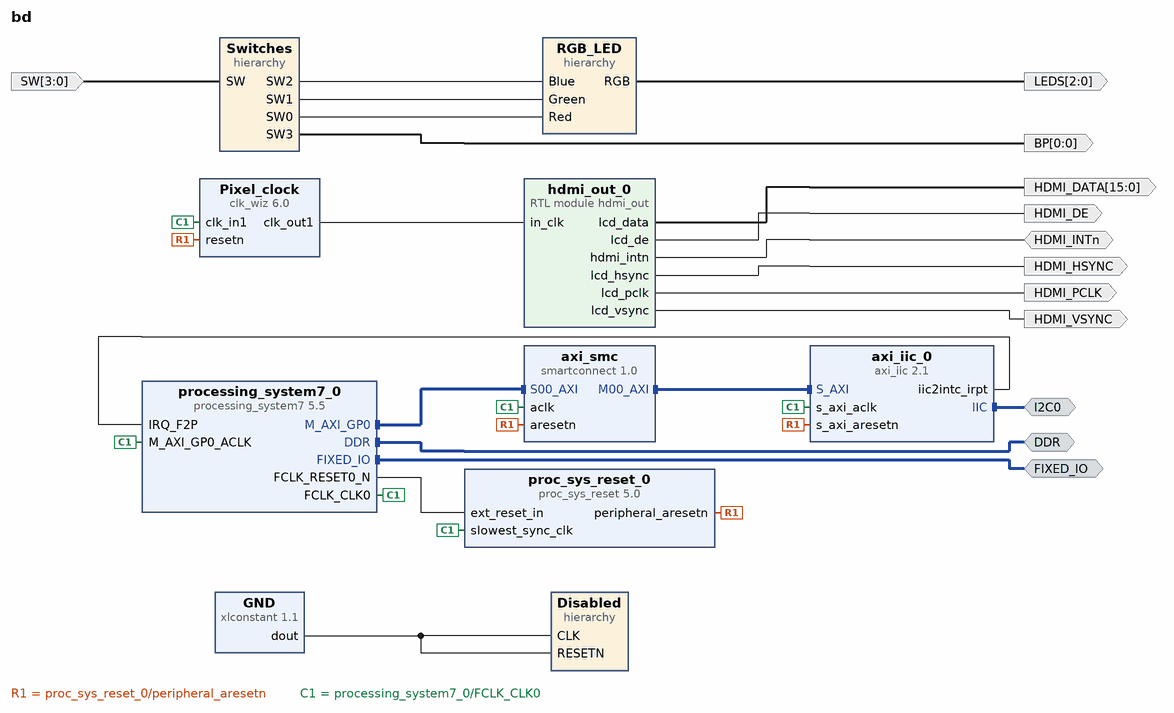
[diagram p0: block diagram of the top level]
# Vivado block design bd, xc7z020clg400-1, Vivado 2024.2.1
create_bd_design bd

create_bd_intf_port -mode Master -vlnv xilinx.com:interface:ddrx_rtl:1.0 DDR
create_bd_intf_port -mode Master -vlnv xilinx.com:display_processing_system7:fixedio_rtl:1.0 FIXED_IO
create_bd_intf_port -mode Master -vlnv xilinx.com:interface:iic_rtl:1.0 I2C0
create_bd_port -dir O HDMI_PCLK
create_bd_port -dir O -from 15 -to 0 HDMI_DATA
create_bd_port -dir O HDMI_DE
create_bd_port -dir IO HDMI_INTn
create_bd_port -dir O HDMI_VSYNC
create_bd_port -dir O HDMI_HSYNC
create_bd_port -dir I -from 3 -to 0 SW
create_bd_port -dir O -from 2 -to 0 LEDS
create_bd_port -dir O -from 0 -to 0 BP

create_bd_cell -type ip -vlnv xilinx.com:ip:clk_wiz:6.0 Pixel_clock
set_property -dict [list \
  CONFIG.CLKOUT1_JITTER 219.225 \
  CONFIG.CLKOUT1_PHASE_ERROR 300.991 \
  CONFIG.CLKOUT1_REQUESTED_OUT_FREQ 115.2 \
  CONFIG.MMCM_CLKFBOUT_MULT_F 54.000 \
  CONFIG.MMCM_CLKOUT0_DIVIDE_F 9.375 \
  CONFIG.MMCM_DIVCLK_DIVIDE 5 \
  CONFIG.RESET_PORT resetn \
  CONFIG.RESET_TYPE ACTIVE_LOW \
  CONFIG.USE_LOCKED false \
  CONFIG.USE_RESET true \
] [get_bd_cells Pixel_clock]
create_bd_cell -type hier Disabled
create_bd_cell -type hier RGB_LED
create_bd_cell -type ip -vlnv xilinx.com:ip:xlconstant:1.1 GND
set_property -dict {CONFIG.CONST_VAL 0} [get_bd_cells GND]
create_bd_cell -type module -reference hdmi_out hdmi_out_0
create_bd_cell -type ip -vlnv xilinx.com:ip:proc_sys_reset:5.0 proc_sys_reset_0
create_bd_cell -type ip -vlnv xilinx.com:ip:processing_system7:5.5 processing_system7_0
set_property -dict [list \
  CONFIG.PCW_APU_PERIPHERAL_FREQMHZ 666.666666 \
  CONFIG.PCW_ENET0_PERIPHERAL_CLKSRC {ARM PLL} \
  CONFIG.PCW_ENET0_PERIPHERAL_ENABLE 0 \
  CONFIG.PCW_FPGA0_PERIPHERAL_FREQMHZ 100 \
  CONFIG.PCW_FPGA1_PERIPHERAL_FREQMHZ 50 \
  CONFIG.PCW_GPIO_MIO_GPIO_ENABLE 1 \
  CONFIG.PCW_GPIO_MIO_GPIO_IO MIO \
  CONFIG.PCW_GPIO_PERIPHERAL_ENABLE 1 \
  CONFIG.PCW_I2C_PERIPHERAL_FREQMHZ 111.111115 \
  CONFIG.PCW_I2C_RESET_ENABLE 1 \
  CONFIG.PCW_IRQ_F2P_INTR 1 \
  CONFIG.PCW_PRESET_BANK1_VOLTAGE {LVCMOS 1.8V} \
  CONFIG.PCW_QSPI_GRP_FBCLK_ENABLE 1 \
  CONFIG.PCW_QSPI_GRP_FBCLK_IO {MIO 8} \
  CONFIG.PCW_QSPI_GRP_SINGLE_SS_ENABLE 1 \
  CONFIG.PCW_QSPI_GRP_SINGLE_SS_IO {MIO 1 .. 6} \
  CONFIG.PCW_QSPI_PERIPHERAL_ENABLE 1 \
  CONFIG.PCW_QSPI_QSPI_IO {MIO 1 .. 6} \
  CONFIG.PCW_SD0_GRP_CD_ENABLE 1 \
  CONFIG.PCW_SD0_GRP_CD_IO {MIO 46} \
  CONFIG.PCW_SD0_GRP_WP_ENABLE 1 \
  CONFIG.PCW_SD0_GRP_WP_IO {MIO 47} \
  CONFIG.PCW_SD0_PERIPHERAL_ENABLE 1 \
  CONFIG.PCW_SD0_SD0_IO {MIO 40 .. 45} \
  CONFIG.PCW_SDIO_PERIPHERAL_FREQMHZ 100 \
  CONFIG.PCW_SINGLE_QSPI_DATA_MODE x4 \
  CONFIG.PCW_UART1_PERIPHERAL_ENABLE 1 \
  CONFIG.PCW_UART1_UART1_IO {MIO 48 .. 49} \
  CONFIG.PCW_UART_PERIPHERAL_FREQMHZ 100 \
  CONFIG.PCW_UIPARAM_DDR_PARTNO {MT41J256M16 RE-125} \
  CONFIG.PCW_USB0_PERIPHERAL_ENABLE 0 \
  CONFIG.PCW_USB_RESET_ENABLE 1 \
  CONFIG.PCW_USE_FABRIC_INTERRUPT 1 \
] [get_bd_cells processing_system7_0]
# 285 more settings of processing_system7_0 are not shown: defaults, MIO pin electricals, DDR timing, and values the tool derives
create_bd_cell -type hier Switches
create_bd_cell -type ip -vlnv xilinx.com:ip:smartconnect:1.0 axi_smc
set_property -dict {CONFIG.NUM_SI 1} [get_bd_cells axi_smc]
create_bd_cell -type ip -vlnv xilinx.com:ip:axi_iic:2.1 axi_iic_0
set_property -dict {CONFIG.IIC_BOARD_INTERFACE i2c0 CONFIG.USE_BOARD_FLOW true} [get_bd_cells axi_iic_0]

# ---- hierarchy /Disabled ----
current_bd_instance /Disabled
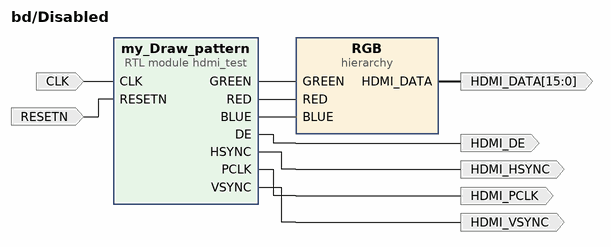
[diagram p1: block diagram inside /Disabled]
create_bd_pin -dir I -type clk CLK
create_bd_pin -dir I -type rst RESETN
create_bd_pin -dir O -from 15 -to 0 HDMI_DATA
create_bd_pin -dir O HDMI_PCLK
create_bd_pin -dir O HDMI_DE
create_bd_pin -dir O HDMI_VSYNC
create_bd_pin -dir O HDMI_HSYNC

create_bd_cell -type module -reference hdmi_test my_Draw_pattern
create_bd_cell -type hier RGB

# ---- hierarchy /Disabled/RGB ----
current_bd_instance /Disabled/RGB
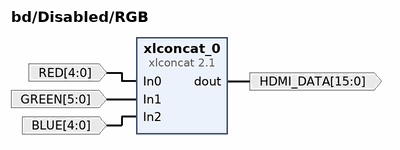
[diagram p2: block diagram inside /Disabled/RGB]
create_bd_pin -dir I -from 5 -to 0 GREEN
create_bd_pin -dir I -from 4 -to 0 RED
create_bd_pin -dir I -from 4 -to 0 BLUE
create_bd_pin -dir O -from 15 -to 0 HDMI_DATA

create_bd_cell -type ip -vlnv xilinx.com:ip:xlconcat:2.1 xlconcat_0
set_property -dict [list \
  CONFIG.IN0_WIDTH 5 \
  CONFIG.IN1_WIDTH 6 \
  CONFIG.IN2_WIDTH 5 \
  CONFIG.IN3_WIDTH 1 \
  CONFIG.IN4_WIDTH 1 \
  CONFIG.IN5_WIDTH 1 \
  CONFIG.IN6_WIDTH 1 \
  CONFIG.NUM_PORTS 3 \
] [get_bd_cells xlconcat_0]

# ---- hierarchy /RGB_LED ----
current_bd_instance /RGB_LED
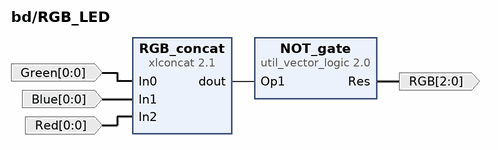
[diagram p3: block diagram inside /RGB_LED]
create_bd_pin -dir O -from 2 -to 0 RGB
create_bd_pin -dir I -from 0 -to 0 Green
create_bd_pin -dir I -from 0 -to 0 Red
create_bd_pin -dir I -from 0 -to 0 Blue

create_bd_cell -type ip -vlnv xilinx.com:ip:xlconcat:2.1 RGB_concat
set_property -dict {CONFIG.NUM_PORTS 3} [get_bd_cells RGB_concat]
create_bd_cell -type ip -vlnv xilinx.com:ip:util_vector_logic:2.0 NOT_gate
set_property -dict {CONFIG.C_OPERATION not CONFIG.C_SIZE 3} [get_bd_cells NOT_gate]

# ---- hierarchy /Switches ----
current_bd_instance /Switches
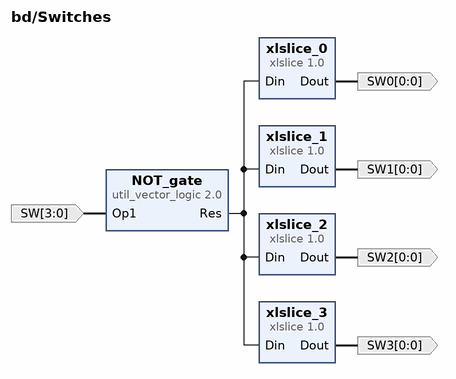
[diagram p4: block diagram inside /Switches]
create_bd_pin -dir I -from 3 -to 0 SW
create_bd_pin -dir O -from 0 -to 0 SW0
create_bd_pin -dir O -from 0 -to 0 SW1
create_bd_pin -dir O -from 0 -to 0 SW2
create_bd_pin -dir O -from 0 -to 0 SW3

create_bd_cell -type ip -vlnv xilinx.com:ip:xlslice:1.0 xlslice_3
set_property -dict {CONFIG.DIN_FROM 0 CONFIG.DIN_TO 0 CONFIG.DIN_WIDTH 4} [get_bd_cells xlslice_3]
create_bd_cell -type ip -vlnv xilinx.com:ip:xlslice:1.0 xlslice_2
set_property -dict {CONFIG.DIN_FROM 1 CONFIG.DIN_TO 1 CONFIG.DIN_WIDTH 4} [get_bd_cells xlslice_2]
create_bd_cell -type ip -vlnv xilinx.com:ip:xlslice:1.0 xlslice_1
set_property -dict {CONFIG.DIN_FROM 2 CONFIG.DIN_TO 2 CONFIG.DIN_WIDTH 4} [get_bd_cells xlslice_1]
create_bd_cell -type ip -vlnv xilinx.com:ip:xlslice:1.0 xlslice_0
set_property -dict {CONFIG.DIN_FROM 3 CONFIG.DIN_TO 3 CONFIG.DIN_WIDTH 4} [get_bd_cells xlslice_0]
create_bd_cell -type ip -vlnv xilinx.com:ip:util_vector_logic:2.0 NOT_gate
set_property -dict {CONFIG.C_OPERATION not CONFIG.C_SIZE 4} [get_bd_cells NOT_gate]

# ---- connections ----

current_bd_instance /Disabled
connect_bd_net -net GREEN_1 [get_bd_pins my_Draw_pattern/GREEN] [get_bd_pins RGB/GREEN]
connect_bd_net -net RED_1 [get_bd_pins my_Draw_pattern/RED] [get_bd_pins RGB/RED]
connect_bd_net [get_bd_pins RGB/HDMI_DATA] [get_bd_pins HDMI_DATA]
connect_bd_net [get_bd_pins my_Draw_pattern/BLUE] [get_bd_pins RGB/BLUE]
connect_bd_net [get_bd_pins my_Draw_pattern/DE] [get_bd_pins HDMI_DE]
connect_bd_net [get_bd_pins my_Draw_pattern/HSYNC] [get_bd_pins HDMI_HSYNC]
connect_bd_net [get_bd_pins my_Draw_pattern/PCLK] [get_bd_pins HDMI_PCLK]
connect_bd_net [get_bd_pins my_Draw_pattern/VSYNC] [get_bd_pins HDMI_VSYNC]
connect_bd_net -net processing_system7_0_FCLK_CLK0 [get_bd_pins CLK] [get_bd_pins my_Draw_pattern/CLK]
connect_bd_net -net rst_ps7_0_100M_peripheral_aresetn [get_bd_pins RESETN] [get_bd_pins my_Draw_pattern/RESETN]

current_bd_instance /Disabled/RGB
connect_bd_net -net In0_0_1 [get_bd_pins RED] [get_bd_pins xlconcat_0/In0]
connect_bd_net -net In1_0_1 [get_bd_pins GREEN] [get_bd_pins xlconcat_0/In1]
connect_bd_net -net In2_0_1 [get_bd_pins BLUE] [get_bd_pins xlconcat_0/In2]
connect_bd_net [get_bd_pins xlconcat_0/dout] [get_bd_pins HDMI_DATA]

current_bd_instance /RGB_LED
connect_bd_net -net In0_1 [get_bd_pins Green] [get_bd_pins RGB_concat/In0]
connect_bd_net -net In1_1 [get_bd_pins Blue] [get_bd_pins RGB_concat/In1]
connect_bd_net -net In2_1 [get_bd_pins Red] [get_bd_pins RGB_concat/In2]
connect_bd_net -net concatenation_dout [get_bd_pins RGB_concat/dout] [get_bd_pins NOT_gate/Op1]
connect_bd_net -net util_vector_logic_0_Res [get_bd_pins NOT_gate/Res] [get_bd_pins RGB]

current_bd_instance /Switches
connect_bd_net [get_bd_pins NOT_gate/Res] \
  [get_bd_pins xlslice_3/Din] [get_bd_pins xlslice_2/Din] [get_bd_pins xlslice_1/Din] [get_bd_pins xlslice_0/Din]
connect_bd_net [get_bd_pins SW] [get_bd_pins NOT_gate/Op1]
connect_bd_net [get_bd_pins xlslice_0/Dout] [get_bd_pins SW0]
connect_bd_net [get_bd_pins xlslice_1/Dout] [get_bd_pins SW1]
connect_bd_net [get_bd_pins xlslice_2/Dout] [get_bd_pins SW2]
connect_bd_net [get_bd_pins xlslice_3/Dout] [get_bd_pins SW3]

current_bd_instance /
connect_bd_intf_net [get_bd_intf_ports I2C0] [get_bd_intf_pins axi_iic_0/IIC]
connect_bd_intf_net [get_bd_intf_pins axi_smc/M00_AXI] [get_bd_intf_pins axi_iic_0/S_AXI]
connect_bd_intf_net [get_bd_intf_ports DDR] [get_bd_intf_pins processing_system7_0/DDR]
connect_bd_intf_net [get_bd_intf_ports FIXED_IO] [get_bd_intf_pins processing_system7_0/FIXED_IO]
connect_bd_intf_net [get_bd_intf_pins processing_system7_0/M_AXI_GP0] [get_bd_intf_pins axi_smc/S00_AXI]
connect_bd_net -net Blue_1 [get_bd_pins Switches/SW2] [get_bd_pins RGB_LED/Blue]
connect_bd_net [get_bd_pins GND/dout] [get_bd_pins Disabled/CLK] [get_bd_pins Disabled/RESETN]
connect_bd_net -net Green_1 [get_bd_pins Switches/SW1] [get_bd_pins RGB_LED/Green]
connect_bd_net [get_bd_ports HDMI_INTn] [get_bd_pins hdmi_out_0/hdmi_intn]
connect_bd_net [get_bd_pins Pixel_clock/clk_out1] [get_bd_pins hdmi_out_0/in_clk]
connect_bd_net -net RGB_LED_LEDS [get_bd_pins RGB_LED/RGB] [get_bd_ports LEDS]
connect_bd_net -net Red_1 [get_bd_pins Switches/SW0] [get_bd_pins RGB_LED/Red]
connect_bd_net [get_bd_ports SW] [get_bd_pins Switches/SW]
connect_bd_net [get_bd_pins Switches/SW3] [get_bd_ports BP]
connect_bd_net [get_bd_pins axi_iic_0/iic2intc_irpt] [get_bd_pins processing_system7_0/IRQ_F2P]
connect_bd_net [get_bd_pins hdmi_out_0/lcd_data] [get_bd_ports HDMI_DATA]
connect_bd_net [get_bd_pins hdmi_out_0/lcd_de] [get_bd_ports HDMI_DE]
connect_bd_net [get_bd_pins hdmi_out_0/lcd_hsync] [get_bd_ports HDMI_HSYNC]
connect_bd_net [get_bd_pins hdmi_out_0/lcd_pclk] [get_bd_ports HDMI_PCLK]
connect_bd_net [get_bd_pins hdmi_out_0/lcd_vsync] [get_bd_ports HDMI_VSYNC]
connect_bd_net [get_bd_pins proc_sys_reset_0/peripheral_aresetn] \
  [get_bd_pins Pixel_clock/resetn] [get_bd_pins axi_smc/aresetn] [get_bd_pins axi_iic_0/s_axi_aresetn]
connect_bd_net [get_bd_pins processing_system7_0/FCLK_CLK0] \
  [get_bd_pins Pixel_clock/clk_in1] [get_bd_pins proc_sys_reset_0/slowest_sync_clk] [get_bd_pins axi_smc/aclk] \
  [get_bd_pins processing_system7_0/M_AXI_GP0_ACLK] [get_bd_pins axi_iic_0/s_axi_aclk]
connect_bd_net [get_bd_pins processing_system7_0/FCLK_RESET0_N] [get_bd_pins proc_sys_reset_0/ext_reset_in]
set_property PFM.CLOCK {FCLK_CLK0 {id "3" is_default "true" proc_sys_reset "/proc_sys_reset_0" status "fixed" freq_hz "100000000"}} [get_bd_cells processing_system7_0]

# ---- address map ----
assign_bd_address -offset 0x41600000 -range 64K -target_address_space [get_bd_addr_spaces processing_system7_0/Data] [get_bd_addr_segs axi_iic_0/S_AXI/Reg]

validate_bd_design
save_bd_design
